# Altium schematic sheet MAGI'sUSBMeterV2.SchDoc
size A4
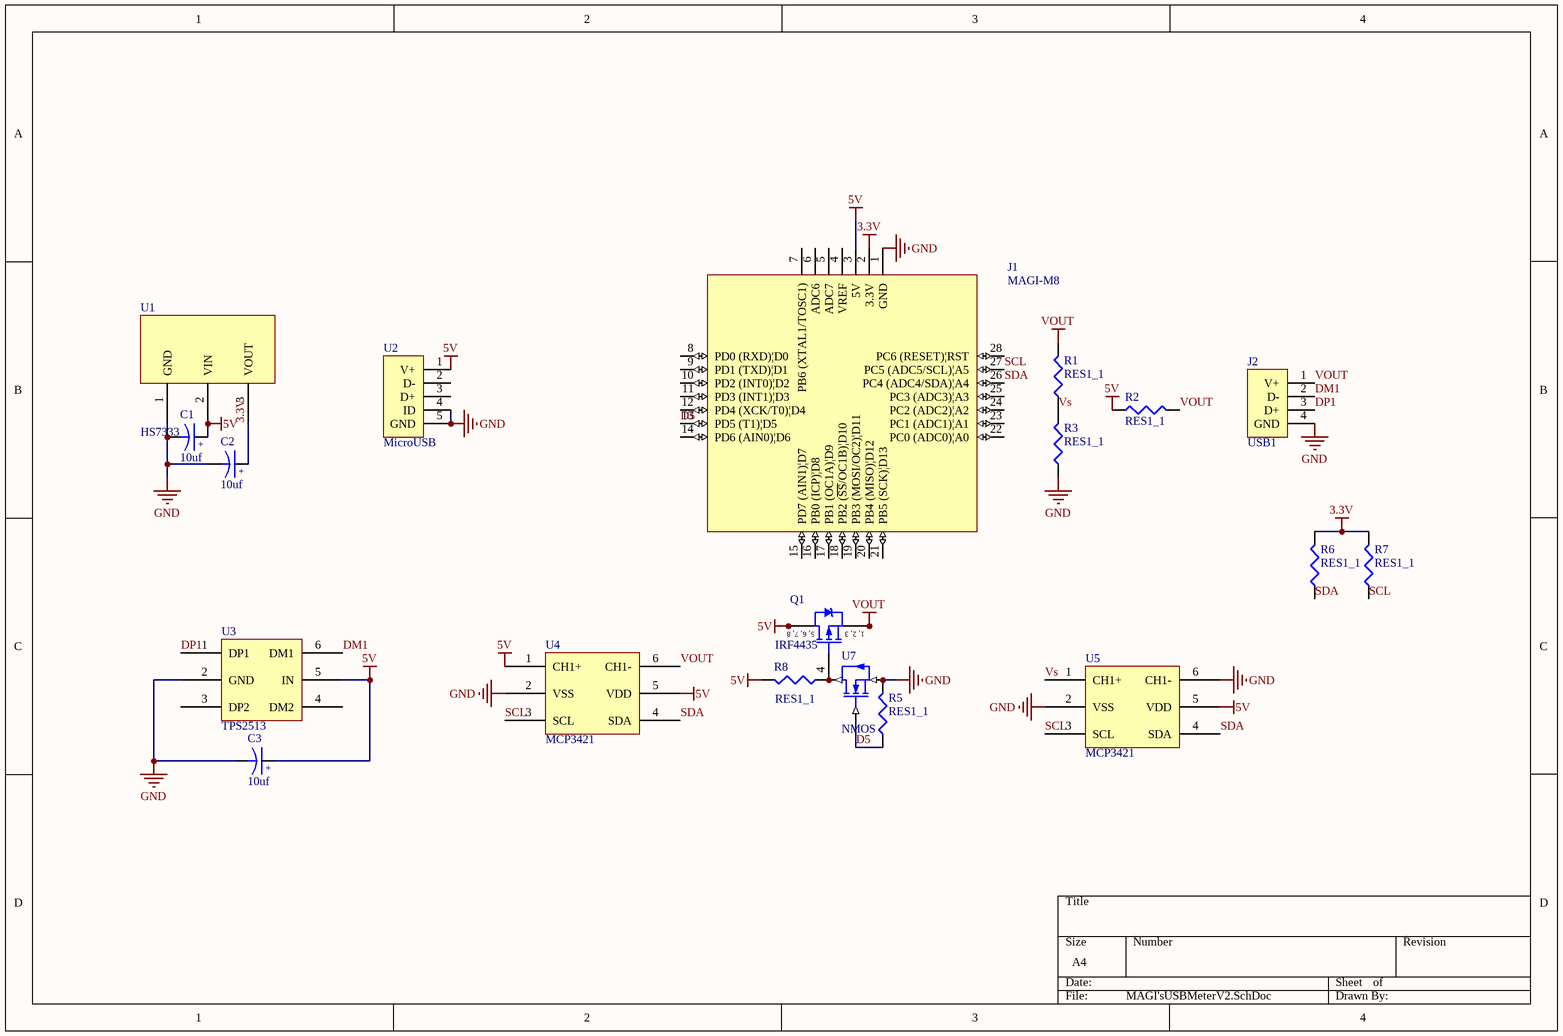
[diagram p0: MAGI'sUSBMeterV2.SchDoc]

## Parts
C1  10uf  [6-0805_N]
C2  10uf  [6-0805_N]
C3  10uf  [6-0805_N]
J1  MAGI-M8  [MAGI-M8]
J2  USB1  [USB-04A]
Q1  IRF4435  [SO-8_N]
R1  RES1_1  [6-0805_N]
R2  RES1_1  [2512]
R3  RES1_1  [6-0805_N]
R5  RES1_1  [6-0805_N]
R6  RES1_1  [6-0805_N]
R7  RES1_1  [6-0805_N]
R8  RES1_1  [6-0805_N]
U1  HS7333  [HS7333]
U2  MicroUSB  [microusb]
U3  TPS2513  [TPS2513]
U4  MCP3421  [tps2513]
U5  MCP3421  [tps2513]
U7  NMOS  [SOT23_n]

## Nets
3.3V: C2.1 J1.2(3.3V) R6.1 R7.1 U1.3(VOUT)
5V: C1.1 C3.1 J1.3(5V) Q1.5(D) Q1.6(D) Q1.7(D) Q1.8(D) R2.1 R8.1 U1.2(VIN) U2.1(V+) U3.5(IN) U4.1(CH1+) U4.5(VDD) U5.5(VDD)
GND: C1.2 C2.2 C3.2 J1.1(GND) J2.4(GND) R3.1 R5.1 U1.1(GND) U2.4(ID) U2.5(GND) U3.2(GND) U4.2(VSS) U5.2(VSS) U5.6(CH1-) U7.2(S)
VOUT: J2.1(V+) Q1.1(S) Q1.2(S) Q1.3(S) R1.2 R2.2 U4.6(CH1-)
D5: J1.13(PD5_(T1)|D5) R5.2 U7.3(G)
DM1: J2.2(D-) U3.6(DM1)
DP1: J2.3(D+) U3.1(DP1)
SCL: J1.27(PC5_(ADC5/SCL)|A5) R7.2 U4.3(SCL) U5.3(SCL)
SDA: J1.26(PC4_(ADC4/SDA)|A4) R6.2 U4.4(SDA) U5.4(SDA)
Vs: R1.1 R3.2 U5.1(CH1+)
NetQ1_4: Q1.4(G) R8.2 U7.1(D)

Not connected (* = marked no-connect by the designer): J1 4(VREF) 5(ADC7) 6(ADC6) 7(PB6_(XTAL1/TOSC1)) 8(PD0_(RXD)|D0) 9(PD1_(TXD)|D1) 10(PD2_(INT0)|D2) 11(PD3_(INT1)|D3) 12(PD4_(XCK/T0)|D4) 14(PD6_(AIN0)|D6) 15(PD7_(AIN1)|D7) 16(PB0_(ICP)|D8) 17(PB1_(OC1A)|D9) 18(PB2_(~{SS}/OC1B)|D10) 19(PB3_(MOSI/OC2)|D11) 20(PB4_(MISO)|D12) 21(PB5_(SCK)|D13) 22(PC0_(ADC0)|A0) 23(PC1_(ADC1)|A1) 24(PC2_(ADC2)|A2) 25(PC3_(ADC3)|A3) 28(PC6_(RESET)|RST); U2 2(D-) 3(D+); U3 3(DP2) 4(DM2)

## Notes on the sheet
- (in symbol CAPACITOR POL) +
- (in symbol IRF4435) 5, 6, 7, 8; 1, 2, 3

## Library data of the parts
C1-C3 = CAPACITOR POL: Capacitor
Q1 = IRF4435: HEXFET Power MOSFET; Published: 17-Sep-2003; LatestRevisionDate: 13-Apr-2006; LatestRevisionNote: IPC-7351 Footprint Added.; DatasheetVersion: 12-Jun-2001; PackageVersion: Feb-2001; PackageReference: SO-8; Publisher: Altium Limited; PackageDescription: 8-Pin Plastic Small Outline Integrated Circuit 1.27 mm Pitch; Code_JEDEC: MS-012-AA; Code_IPC: SOIC127P600-8; ComponentLink1Description: Manufacturer Link; ComponentLink1URL: http://www.irf.com/; ComponentLink2Description: Datasheet; ComponentLink2URL: http://www.irf.com/product-info/datasheets/data/IRF4435.pdf
U2 = MicroUSB2.0
U7 = NMOS: TO252